# Altium schematic sheet AI.SchDoc
size 420 x 297 mm; SheetNumber: 12; SheetTotal: 13
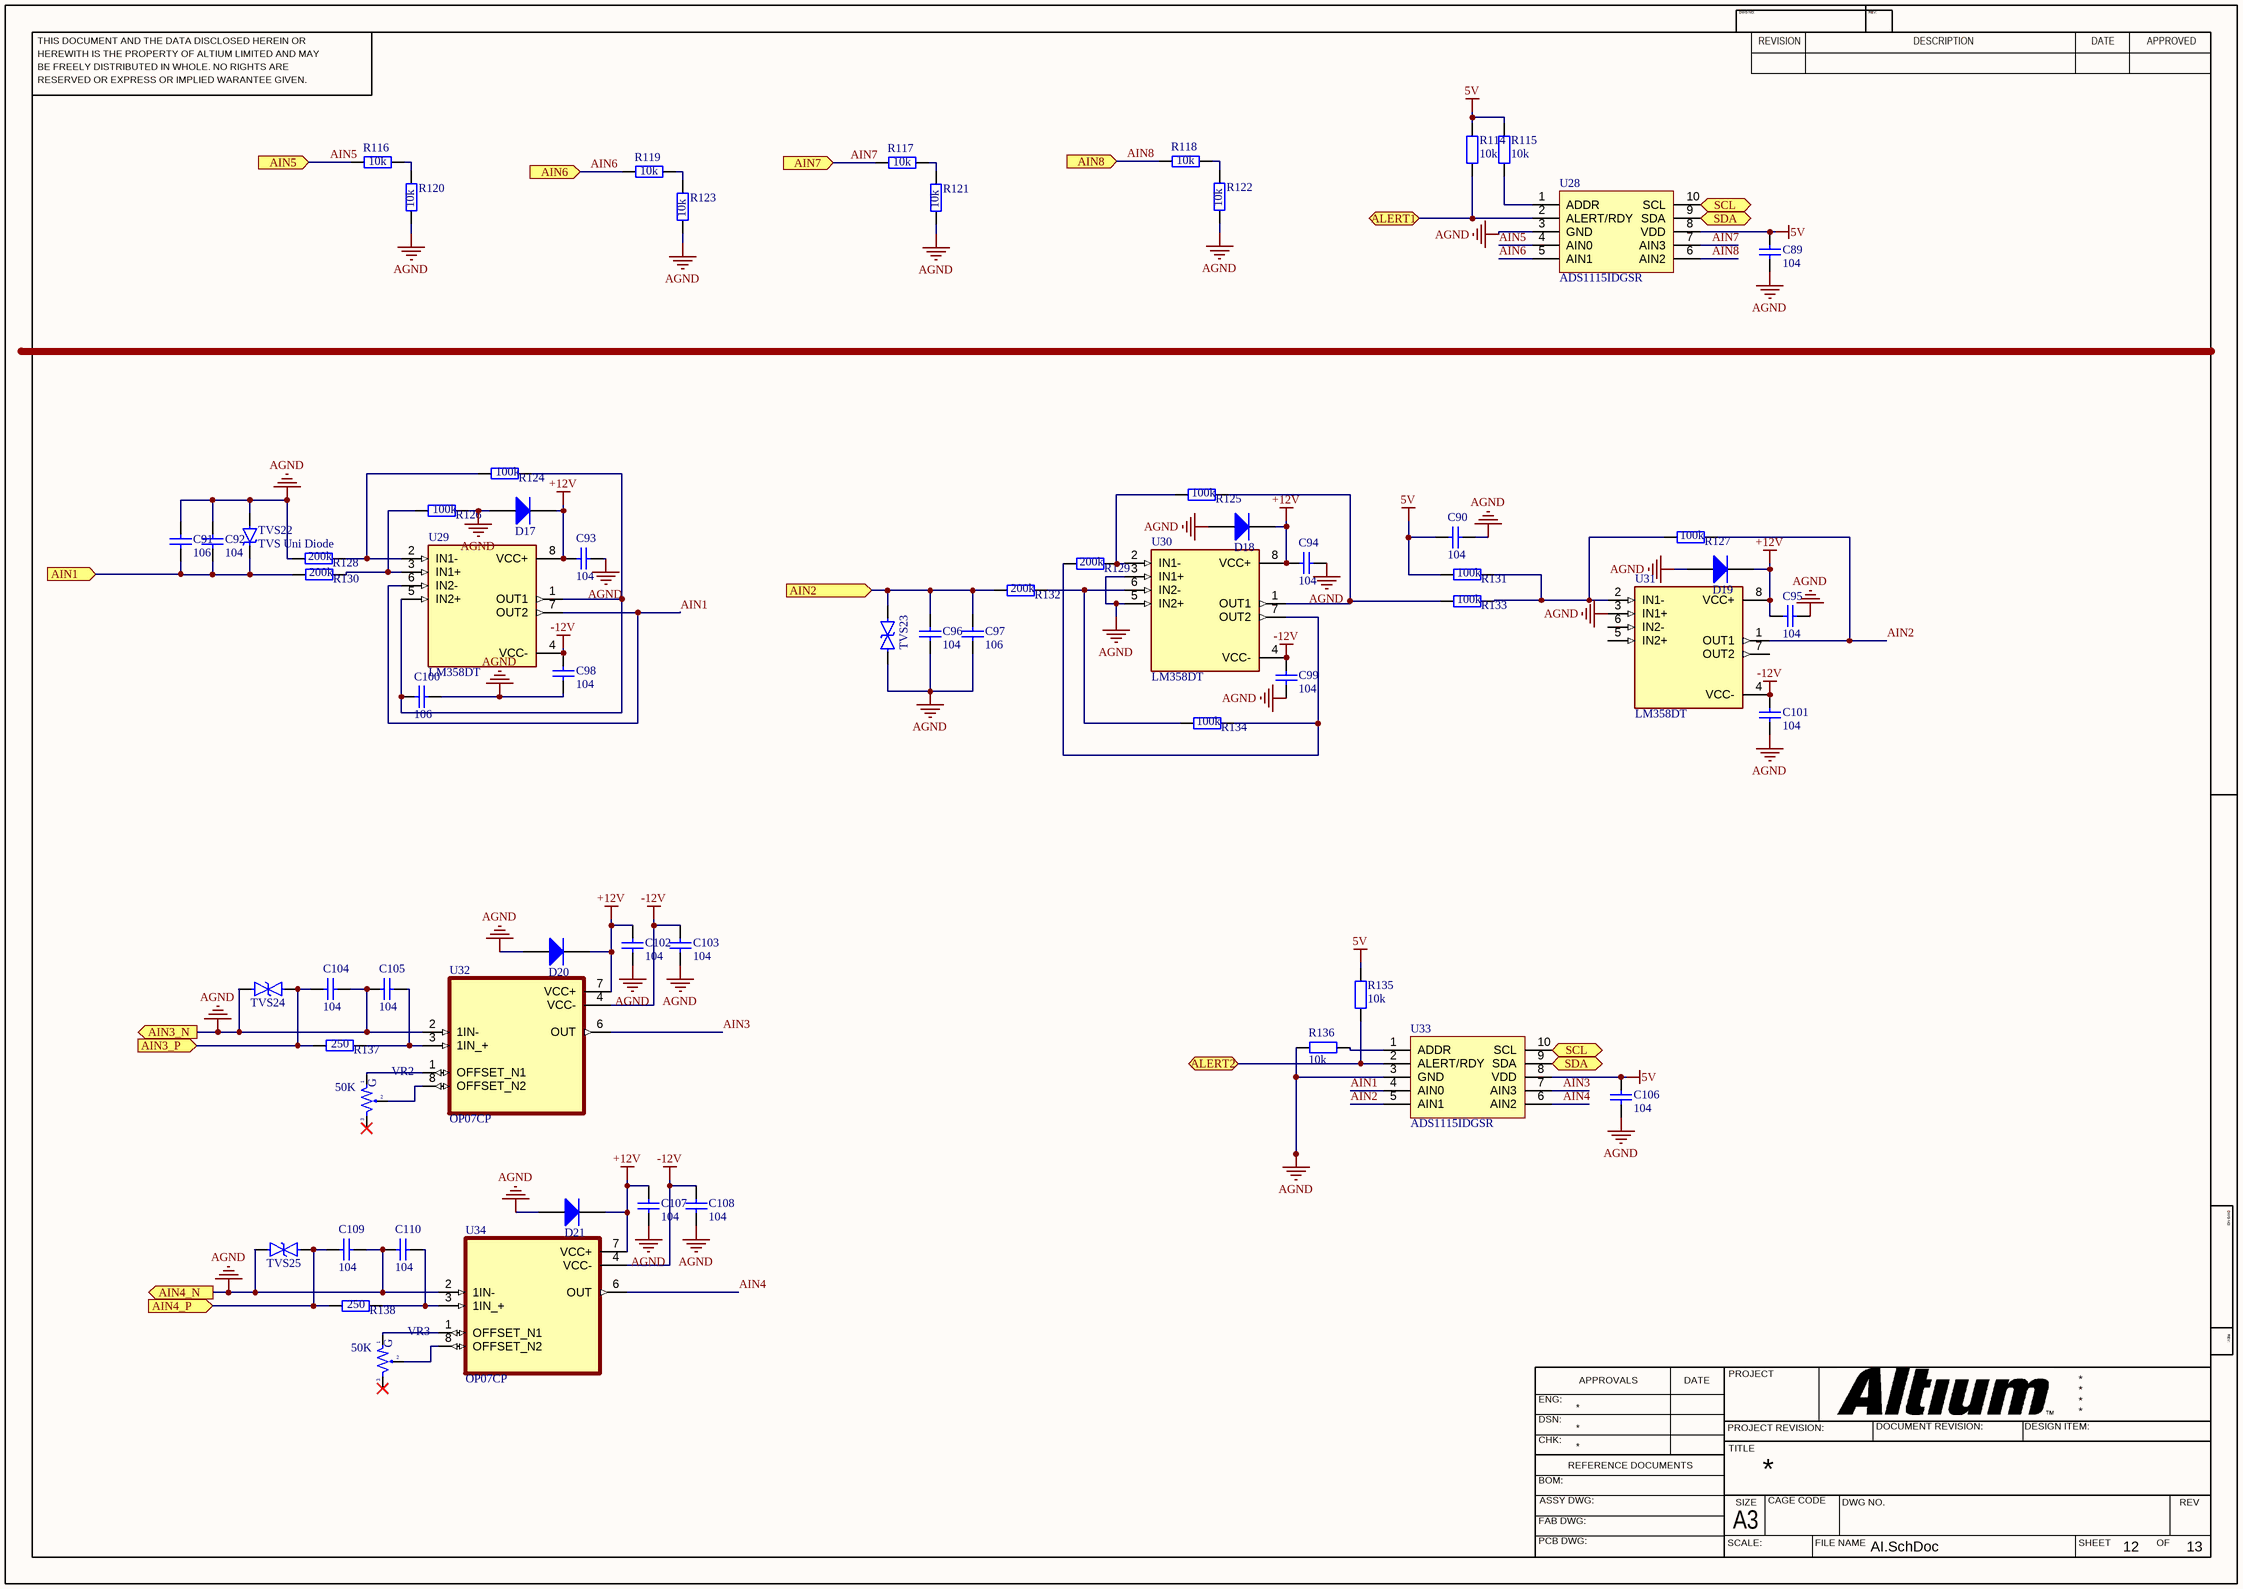
[diagram p0: AI.SchDoc]

## Parts
C89  104  [0603_Cap]
C90  104  [0603_Cap]
C91  106  [1206_CAP]
C92  104  [0603_Cap]
C93  104  [0603_Cap]
C94  104  [0603_Cap]
C95  104  [0603_Cap]
C96  104  [0603_Cap]
C97  106  [1206_CAP]
C98  104  [0603_Cap]
C99  104  [0603_Cap]
C100  106  [1206_CAP]
C101  104  [0603_Cap]
C102  104  [0603_Cap]
C103  104  [0603_Cap]
C104  104  [0603_Cap]
C105  104  [0603_Cap]
C106  104  [0603_Cap]
C107  104  [0603_Cap]
C108  104  [0603_Cap]
C109  104  [0603_Cap]
C110  104  [0603_Cap]
D17  RS3M  [SMC - DO-214]  (value not drawn)
D18  RS3M  [SMC - DO-214]  (value not drawn)
D19  RS3M  [SMC - DO-214]  (value not drawn)
D20  RS3M  [SMC - DO-214]  (value not drawn)
D21  RS3M  [SMC - DO-214]  (value not drawn)
R114  10k  [0603_Res]
R115  10k  [0603_Res]
R116  10k  [0603_Res]
R117  10k  [0603_Res]
R118  10k  [0603_Res]
R119  10k  [0603_Res]
R120  10k  [0603_Res]
R121  10k  [0603_Res]
R122  10k  [0603_Res]
R123  10k  [0603_Res]
R124  100k  [0603_Res]
R125  100k  [0603_Res]
R126  100k  [0603_Res]
R127  100k  [0603_Res]
R128  200k  [0603_Res]
R129  200k  [0603_Res]
R130  200k  [0603_Res]
R131  100k  [0603_Res]
R132  200k  [0603_Res]
R133  100k  [0603_Res]
R134  100k  [0603_Res]
R135  10k  [0603_Res]
R136  10k  [0603_Res]
R137  250  [0603_Res]
R138  250  [0603_Res]
TVS22  TVS Uni Diode  [SMA - DO-214AC]
TVS23  SMBJ12CA  [SMB - DO-214AA]  (value not drawn)
TVS24  SMBJ12CA  [SMB - DO-214AA]  (value not drawn)
TVS25  SMBJ12CA  [SMB - DO-214AA]  (value not drawn)
U28  ADS1115IDGSR  [VSOP-10_19.6_230_57X12_SMD]
U29  LM358DT  [SOIC127P600X175-8N]
U30  LM358DT  [SOIC127P600X175-8N]
U31  LM358DT  [SOIC127P600X175-8N]
U32  OP07CP  [DIP794W45P254L959H508Q8]
U33  ADS1115IDGSR  [VSOP-10_19.6_230_57X12_SMD]
U34  OP07CP  [DIP794W45P254L959H508Q8]
VR2  50K  [VR-S3]
VR3  50K  [VR-S3]

## Ports
AIN1 (in), AIN2 (in), AIN3_N (out), AIN3_P (in), AIN4_N (out), AIN4_P (in), AIN5 (in), AIN6 (in), AIN7 (in), AIN8 (in), ALERT1 (bidir), ALERT2 (bidir), SCL (bidir), SDA (bidir)

## Nets
5V: C89.2 C90.1 C106.2 R114.2 R115.2 R131.1 R135.2 U28.8(VDD) U33.8(VDD)
+12V: C93.2 C94.1 C95.1 C102.2 C107.2 D17.1 D18.1 D19.1 D20.1 D21.1 U29.8(VCC+) U30.8(VCC+) U31.8(VCC+) U32.7(VCC+) U34.7(VCC+)
-12V: C98.1 C99.1 C101.1 C103.1 C108.1 U29.4(VCC-) U30.4(VCC-) U31.4(VCC-) U32.4(VCC-) U34.4(VCC-)
AGND: C89.1 C90.2 C91.1 C92.2 C93.1 C94.2 C95.2 C96.2 C97.1 C98.2 C99.2 C100.2 C101.2 C102.1 C103.2 C104.2 C105.2 C106.1 C107.1 C108.2 C109.2 C110.2 D17.2 D18.2 D19.2 D20.2 D21.2 R120.1 R121.1 R122.1 R123.1 R126.2 R128.1 R136.1 TVS22.2 TVS23.1 TVS24.2 TVS25.2 U28.3(GND) U30.3(IN1+) U30.5(IN2+) U31.3(IN1+) U32.2(1IN-) U33.3(GND) U34.2(1IN-) ; port AIN3_N, port AIN4_N
AIN1: U29.6(IN2-) U29.7(OUT2) U33.4(AIN0)
AIN1: C91.2 C92.1 R130.1 TVS22.1 ; port AIN1  [a separate net that carries the same name]
AIN2: C96.1 C97.2 R132.1 TVS23.2 ; port AIN2
AIN2: R127.2 U31.1(OUT1) U33.5(AIN1)  [a separate net that carries the same name]
AIN3: U32.6(OUT) U33.7(AIN3)
AIN3_P: C104.1 R137.1 TVS24.1 ; port AIN3_P
AIN4: U33.6(AIN2) U34.6(OUT)
AIN4_P: C109.1 R138.1 TVS25.1 ; port AIN4_P
AIN5: R116.1 U28.4(AIN0) ; port AIN5
AIN6: R119.1 U28.5(AIN1) ; port AIN6
AIN7: R117.1 U28.7(AIN3) ; port AIN7
AIN8: R118.1 U28.6(AIN2) ; port AIN8
ALERT1: R114.1 U28.2(ALERT/RDY) ; port ALERT1
ALERT2: R135.1 U33.2(ALERT/RDY) ; port ALERT2
SCL: U28.10(SCL) U33.10(SCL) ; port SCL
SDA: U28.9(SDA) U33.9(SDA) ; port SDA
NetC100_1: C100.1 R124.2 U29.1(OUT1) U29.5(IN2+)
NetC105_1: C105.1 R137.2 U32.3(1IN_+)
NetC110_1: C110.1 R138.2 U34.3(1IN_+)
NetR115_1: R115.1 U28.1(ADDR)
NetR116_2: R116.2 R120.2
NetR117_2: R117.2 R121.2
NetR118_2: R118.2 R122.2
NetR119_2: R119.2 R123.2
NetR124_1: R124.1 R128.2 U29.2(IN1-)
NetR125_1: R125.1 R129.2 U30.2(IN1-)
NetR125_2: R125.2 R133.1 U30.1(OUT1)
NetR126_1: R126.1 R130.2 U29.3(IN1+)
NetR127_1: R127.1 R131.2 R133.2 U31.2(IN1-)
NetR129_1: R129.1 R134.2 U30.7(OUT2)
NetR132_2: R132.2 R134.1 U30.6(IN2-)
NetR136_2: R136.2 U33.1(ADDR)
NetU32_1: U32.1(OFFSET_N1) VR2.1
NetU32_8: U32.8(OFFSET_N2) VR2.2
NetU34_1: U34.1(OFFSET_N1) VR3.1
NetU34_8: U34.8(OFFSET_N2) VR3.2

Not connected (* = marked no-connect by the designer): U31 5(IN2+) 6(IN2-) 7(OUT2); VR2 3*; VR3 3*

## Notes on the sheet
- THIS DOCUMENT AND THE DATA DISCLOSED HEREIN OR
- HEREWITH IS THE PROPERTY OF ALTIUM LIMITED AND MAY
- DWG NO:
- REVISION
- REV:
- DESCRIPTION
- DATE
- APPROVED
- BE FREELY DISTRIBUTED IN WHOLE. NO RIGHTS ARE
- RESERVED OR EXPRESS OR IMPLIED WARANTEE GIVEN.
- ENG:
- APPROVALS
- PROJECT
- DSN:
- CHK:
- REFERENCE DOCUMENTS
- PROJECT REVISION:
- TITLE
- DOCUMENT REVISION:
- DESIGN ITEM:
- BOM:
- FAB DWG:
- PCB DWG:
- ASSY DWG:
- SCALE:
- A3
- SIZE
- CAGE CODE
- FILE NAME
- DWG NO.
- SHEET
- OF
- REV
- (in symbol VR-S) G

## Library data of the parts
C89-C110 = Ceramic Capacitor: Chung_Loai: Dán; Don_Vi: Con; So_Chan: 2; Ten_Linh_Kien: Tụ 0805 104-100nF 10% 50V; Ma_Hang: MH004551; Kieu_Chan: *
D17-D21 = Diode: Ten_Linh_Kien: Diode S4 SOD123 ( 1N5819 SOD123); Ma_Hang: MH005519; Chung_Loai: Dán; Don_Vi: Con; Ghi_Chu: *; Kieu_Chan: *
R114-R138 = Resistor: Chung_Loai: Dán; Don_Vi: Con; So_Chan: 2; Ten_Linh_Kien: Trở 0805 1% 1k; Ma_Hang: MH005468; Kieu_Chan: *
TVS23-TVS25 = TVS Bi Diode
U28 U33 = IC_ADS1115IDGSR: Analog to Digital Converters - ADC 16B ADC w/ Int MUX PGA Comp Osc & Ref; Manufacturer: Texas Instruments; Alternate Part Number-1: NA; Manufacturer Part Number: ADS1115IDGSR; Case/Package: MSOP-10; Supplier-1: Mouser; Supplier Part Number-1: 595-ADS1115IDGSR
U29-U31 = LM358DT: General Purpose Amplifier 2 Circuit 8-SO; MF: STMicroelectronics; Price: None; Package: SOIC-8 STMicroelectronics; MP: LM358DT; Value: *; Availability: Unavailable; SnapEDA_Link: https://www.snapeda.com/parts/LM358DT/STMicroelectronics/view-part/6634/?ref=snap
U32 U34 = OP07CP: Low-Offset Voltage Operational Amplifier; MF: Texas Instruments; Package: PDIP-8 Texas Instruments; Availability: Unavailable; Texas_Instruments-Purchase-URL: https://snapeda.com/shop?store=Texas+Instruments&id=558076; MP: OP07CP; DigiKey-Purchase-URL: https://snapeda.com/shop?store=DigiKey&id=558076; Value: *; Price: None; SnapEDA_Link: https://www.snapeda.com/parts/OP07CP/Texas%20Instruments/view-part/558076/?ref=snap; Mouser-Purchase-URL: https://snapeda.com/shop?store=Mouser&id=558076
VR2 VR3 = VR-S: Var Resistor; Value: Volume 50k